# Altium schematic sheet sheet_2_AnalogHeart.SchDoc
size A; SheetNumber: 2; SheetTotal: 3
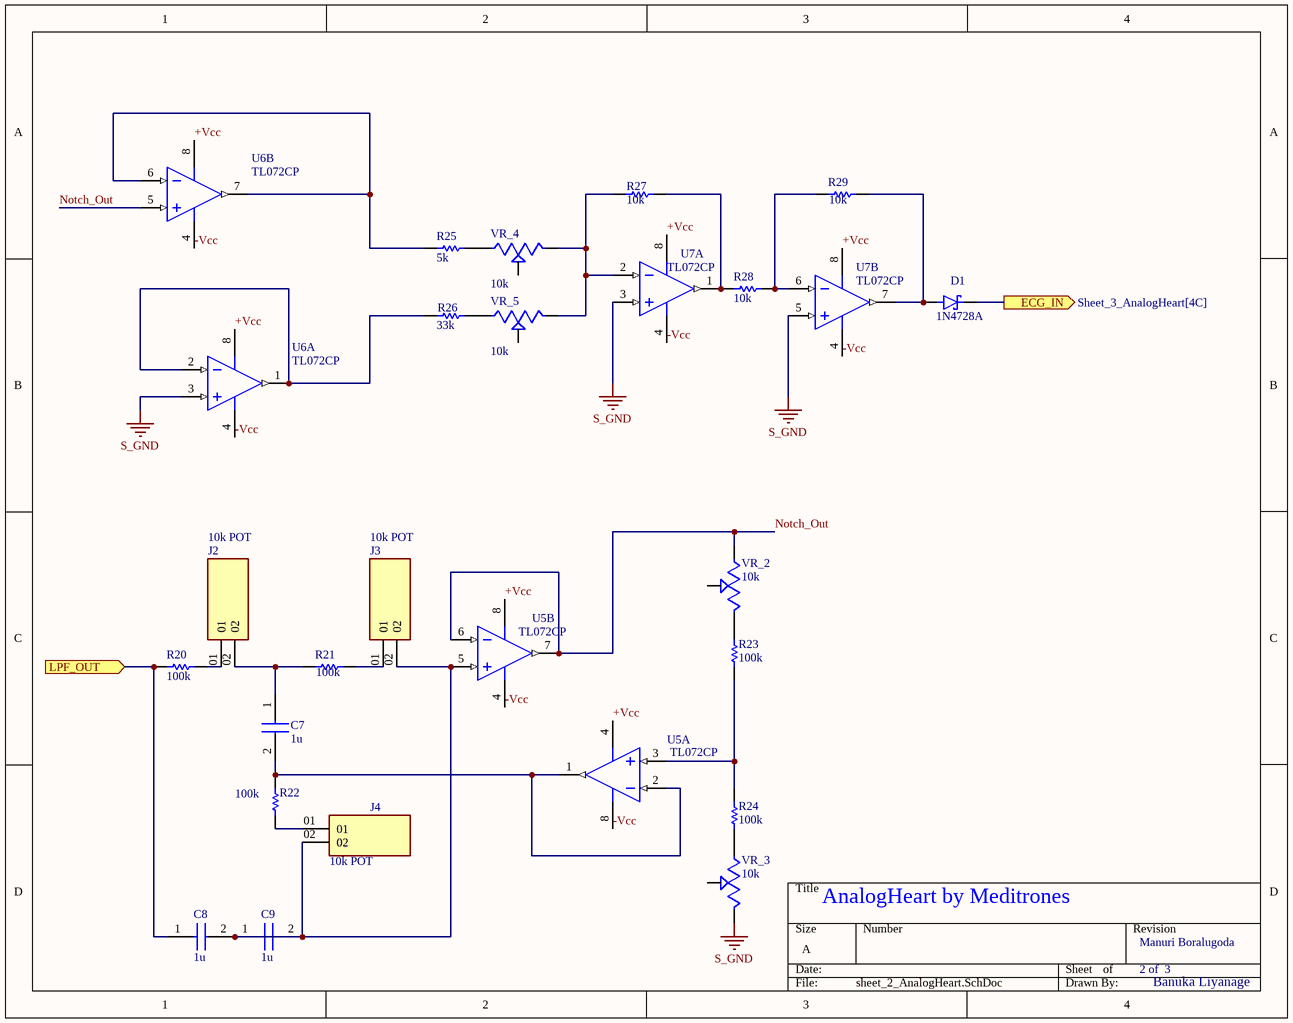
[diagram p0: sheet_2_AnalogHeart.SchDoc]

## Parts
C7  1u  [CAPC2012X94N]
C8  1u  [CAPC2012X94N]
C9  1u  [CAPC2012X94N]
D1  1N4728A  [DIOAD1036W78L463D272]
J2  10k POT  [SAMTEC_MTSW-102-11-T-S-640]
J3  10k POT  [SAMTEC_MTSW-102-11-T-S-640]
J4  10k POT  [SAMTEC_MTSW-102-11-T-S-640]
R20  100k  [RESC2013X50X30NL20T20]
R21  100k  [RESC2013X50X30NL20T20]
R22  100k  [RESC2013X50X30NL20T20]
R23  100k  [RESC2013X50X30NL20T20]
R24  100k  [RESC2013X50X30NL20T20]
R25  5k  [RESC2013X50X30NL20T20]
R26  33k  [RESC2013X50X30NL20T20]
R27  10k  [RESC2013X50X30NL20T20]
R28  10k  [RESC2013X50X30NL20T20]
R29  10k  [RESC2013X50X30NL20T20]
U5  TL072CP  [P0008A]  (parts A,B of 2)
U6  TL072CP  [P0008A]  (parts A,B of 2)
U7  TL072CP  [P0008A]  (parts A,B of 2)
VR_2  10k  [TRIM_3386F-1-103TLF]
VR_3  10k  [TRIM_3386F-1-103TLF]
VR_4  10k  [TRIM_3386F-1-103TLF]
VR_5  10k  [TRIM_3386F-1-103TLF]

## Ports
ECG_IN (out, see Sheet_3_AnalogHeart[4C]), LPF_OUT (in, see analogheart_schem[3C])

## Nets
S_GND: U6.3(IN1+) U7.3(IN1+) U7.5(IN2+) VR_3.3(CW)
+Vcc: U5.4(VCC-) U5.8(VCC+) U6.8(VCC+) U7.8(VCC+)
-Vcc: U5.4(VCC-) U5.8(VCC+) U6.4(VCC-) U7.4(VCC-)
ECG_IN: D1.1(K) ; port ECG_IN
LPF_OUT: C8.1 R20.2 ; port LPF_OUT
Notch_Out: U5.6(IN2-) U5.7(OUT2) U6.5(IN2+) VR_2.1(CCW)
NetC7_1: C7.1 J2.02 R21.2
NetC7_2: C7.2 R22.1 U5.1(OUT1) U5.2(IN1-)
NetC8_2: C8.2 C9.1 C9.2 J3.02 J4.02 U5.5(IN2+)
NetD1_2: D1.2(A) R29.1 U7.7(OUT2)
NetJ2_01: J2.01 R20.1
NetJ3_01: J3.01 R21.1
NetJ4_01: J4.01 R22.2
NetR23_1: R23.1 VR_2.3(CW)
NetR23_2: R23.2 R24.1 U5.3(IN1+)
NetR24_2: R24.2 VR_3.1(CCW)
NetR25_1: R25.1 VR_4.1(CCW)
NetR25_2: R25.2 U6.6(IN2-) U6.7(OUT2)
NetR26_1: R26.1 VR_5.1(CCW)
NetR26_2: R26.2 U6.1(OUT1) U6.2(IN1-)
NetR27_1: R27.1 R28.2 U7.1(OUT1)
NetR27_2: R27.2 U7.2(IN1-) VR_4.3(CW) VR_5.3(CW)
NetR28_1: R28.1 R29.2 U7.6(IN2-)

Not connected (* = marked no-connect by the designer): VR_2 2(WIPER); VR_3 2(WIPER); VR_4 2(WIPER); VR_5 2(WIPER)

## Notes on the sheet
- AnalogHeart by Meditrones
- 2 of  3
- Manuri Boralugoda
- Banuka Liyanage

## Library data of the parts
C7-C9 = 08055A331FAT2A: Capacitor; Manufacturer_Name: Kyocera AVX; Datasheet Link: https://componentsearchengine.com/Datasheets/1/06031A100FAT2A.pdf; Height: 0.94mm; Manufacturer_Part_Number: 08055A331FAT2A; Mouser Part Number: 581-08055A331FAT2A; Mouser Price/Stock: https://www.mouser.com/Search/Refine.aspx?Keyword=581-08055A331FAT2A; Arrow Part Number: 08055A331FAT2A; Arrow Price/Stock: https://www.arrow.com/en/products/08055a331fat2a/avx
D1 = 1N4728A: Ð¡Ñ‚Ð°Ð±Ð¸Ð»Ð¸Ñ‚Ñ€Ð¾Ð½ 3,3 Ð’ 1 Ð’Ñ‚ Â± 5% ÑÐ¾ ÑÐºÐ²Ð¾Ð·Ð½Ñ‹Ð¼ Ð¾Ñ‚Ð²ÐµÑ€ÑÑ‚Ð¸ÐµÐ¼ DO-41; MF: ON Semiconductor; SnapEDA_Link: https://www.snapeda.com/parts/1N4728A/Onsemi/view-part/?ref=snap; Package: DO-41 ON Semiconductor; Value: *; MP: 1N4728A; Check_prices: https://www.snapeda.com/parts/1N4728A/Onsemi/view-part/?ref=eda
J2-J4 = MTSW-102-11-T-S-640: Package: None; Price: None; MP: MTSW-102-11-T-S-640; Availability: Unavailable; Value: *
R20-R29 = CMP-2001-04915-1: Manufacturer: Vishay Dale; Part Number: CRCW080510R0FKEA
U5-U7 = CMP-0017-00950-2: Dual Low-Noise JFET-Input General-Purpose Operational Amplifier, 7 to 36 V, 0 to 70 degC, 8-pin DIP (P8), Pb-Free (RoHS); Manufacturer: Texas Instruments; Sub Family: General Purpose Amplifier, High Supply Voltage Amplifier (>=30V); Total Supply Voltage(Max)(+5V is 5, +/-5V is 10): 36; Slew Rate(Typ)(V/us): 13; Vn at 1kHz(Typ)(nV/rtHz): 18; GBW(Typ)(MHz): 3; CMRR(Min)(dB): 70; Total Supply Voltage(Min)(+5V is 5, +/-5V is 10): 7; Vio (25C)(Max)(mV): 10; Rating: Catalog; IIB(Max)(pA): 200; Iq per channel(Max)(mA): 2.5; Number of Channels: 2; Mounting Technology: Through Hole; ComponentLink3Description: Package Specification; PartNumber: TL072CP; PackageVersion: 4040082/E, 04/2010; Eco-Plan: Pb-Free (RoHS); DatasheetVersion: SLOS080J; Offset Drift(Typ)(uV/C): 18; ComponentLink3URL: http://www.ti.com/litv/pdf/mpdi001b; PackageDescription: 8-Pin Plastic In-Line, Body 9.59 x 6.35 mm, Pitch 2.54 mm; Code_JEDEC: MS-001; ComponentLink2URL: http://www.ti.com/lit/ds/symlink/tl072.pdf; ComponentLink1Description: Manufacturer URL; ComponentLink2Description: Datasheet; ComponentLink1URL: http://www.ti.com/; PackageReference: P0008A
VR_2-VR_5 = 3386F-1-103TLF: 10 kOhms 0.5W, 1/2W PC Pins Through Hole Trimmer Potentiometer Cermet 1.0 Turn Top Finger Adjustment; MF: Bourns; Package: 3386F-3 Bourns; Price: None; Check_prices: https://www.snapeda.com/parts/3386F-1-103TLF/Bourns/view-part/?ref=eda; Value: *; SnapEDA_Link: https://www.snapeda.com/parts/3386F-1-103TLF/Bourns/view-part/?ref=snap; MP: 3386F-1-103TLF; Availability: In Stock; Purchase-URL: https://pricing.snapeda.com/search/part/3386F-1-103TLF/?ref=eda